# Altium project Cashstick.PrjPcb
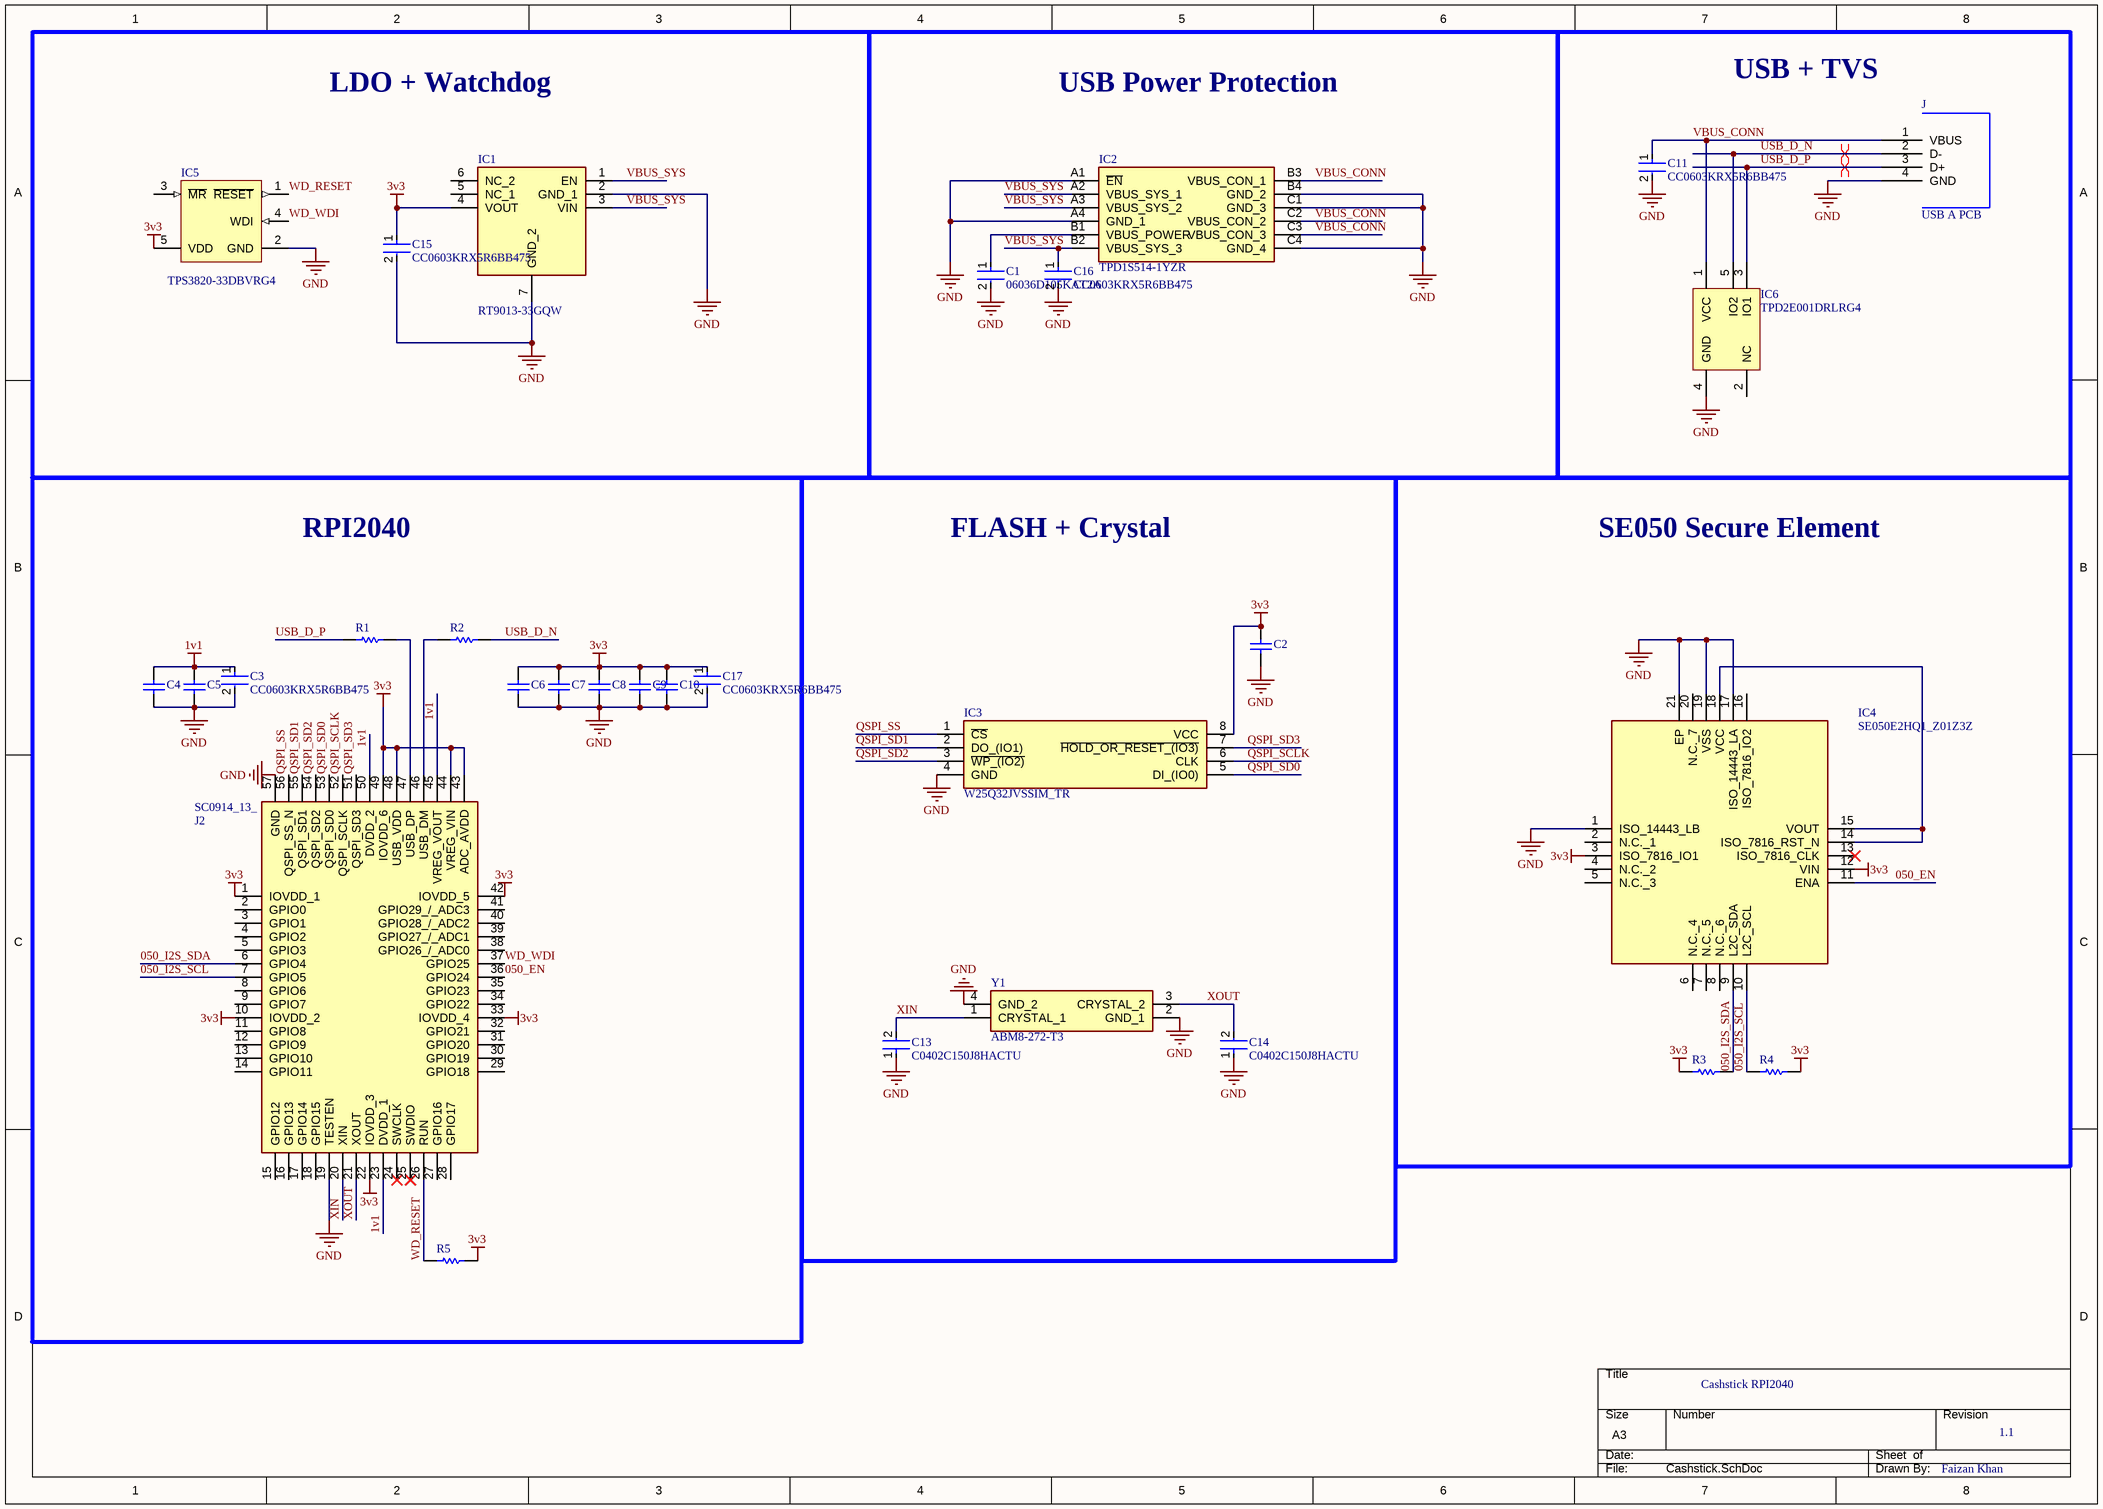
[diagram p0: Cashstick.SchDoc]
1 sheet, 30 parts. Net scope: global (net labels, ports and power ports of the same name join across sheets).
Board file: Cashstick.PcbDoc

## Sheet Cashstick.SchDoc: Cashstick RPI2040
size A3; DrawnBy: Faizan Khan; Organization: ORGANIZATION; Address1: ADDRESS 1; Address2: ADDRESS 2; Address3: ADDRESS 3; Address4: ADDRESS 4; Revision: 1.1; SheetNumber: 1; SheetTotal: 1; ENG_APP_DATE: --/--/--; DSN_APP_DATE: --/--/--; CHK_APP_DATE: --/--/--

### Parts
C1  06036D105KAT2A  [FP-0603-L_1_6_0_15-W_0_81-IPC_A]
C2  0402YC104JAT2A  [CAPC1005X56X25LL10T15]  (value not drawn)
C3  CC0603KRX5R6BB475  [FP-CC0603-DA-MFG]
C4  0402YC104JAT2A  [CAPC1005X56X25LL10T15]  (value not drawn)
C5  0402YC104JAT2A  [CAPC1005X56X25LL10T15]  (value not drawn)
C6  0402YC104JAT2A  [CAPC1005X56X25LL10T15]  (value not drawn)
C7  0402YC104JAT2A  [CAPC1005X56X25LL10T15]  (value not drawn)
C8  0402YC104JAT2A  [CAPC1005X56X25LL10T15]  (value not drawn)
C9  0402YC104JAT2A  [CAPC1005X56X25LL10T15]  (value not drawn)
C10  0402YC104JAT2A  [CAPC1005X56X25LL10T15]  (value not drawn)
C11  CC0603KRX5R6BB475  [FP-CC0603-DA-MFG]
C13  C0402C150J8HACTU  [FP-C0402-BB-MFG]
C14  C0402C150J8HACTU  [FP-C0402-BB-MFG]
C15  CC0603KRX5R6BB475  [FP-CC0603-DA-MFG]
C16  CC0603KRX5R6BB475  [FP-CC0603-DA-MFG]
C17  CC0603KRX5R6BB475  [FP-CC0603-DA-MFG]
IC1  RT9013-33GQW  [SON65P200X200X80-7N]
IC2  TPD1S514-1YZR  [BGA12C40P4X3_199X129X62]
IC3  W25Q32JVSSIM_TR  [SOIC127P790X216-8N]
IC4  SE050E2HQ1_Z01Z3Z  [QFN40P300X300X33-21N-D]
IC5  TPS3820-33DBVRG4  [TI-DBV5_V]
IC6  TPD2E001DRLRG4  [DRL0005A_L]
J  USB A PCB  [USB PCB TRACE]
J2  SC0914_13_  [SC091413]
R1  CR0402-FX-27R4GLF  [RESC1005X40X25ML10T10]  (value not drawn)
R2  CR0402-FX-27R4GLF  [RESC1005X40X25ML10T10]  (value not drawn)
R3  2K2 5% 0402(1005)  [RESC0402(1005)_N]  (value not drawn)
R4  2K2 5% 0402(1005)  [RESC0402(1005)_N]  (value not drawn)
R5  TNPW040210K0DEED  [RESC1005X40X20NL05T10]  (value not drawn)
Y1  ABM8-272-T3  [ABM8272T3]

### Blocks framed on the sheet
LDO + Watchdog: C15 IC1 IC5
USB Power Protection: C1 C16 IC2
USB + TVS: C11 IC6 J
RPI2040: C3-C10 C17 J2 R1 R2 R5
FLASH + Crystal: C2 C13 C14 IC3 Y1
SE050 Secure Element: IC4 R3 R4

### Nets
1v1: C3.1 C4.2 C5.2 J2.23(DVDD_1) J2.45(VREG_VOUT) J2.50(DVDD_2)
3v3: C2.2 C6.2 C7.2 C8.2 C9.2 C10.2 C15.1 C17.1 IC1.4(VOUT) IC3.8(VCC) IC4.3(ISO_7816_IO1) IC4.12(VIN) IC5.5(VDD) J2.1(IOVDD_1) J2.10(IOVDD_2) J2.22(IOVDD_3) J2.33(IOVDD_4) J2.42(IOVDD_5) J2.43(ADC_AVDD) J2.44(VREG_VIN) J2.48(USB_VDD) J2.49(IOVDD_6) R3.1 R4.2 R5.2
GND: C1.2 C2.1 C3.2 C4.1 C5.1 C6.1 C7.1 C8.1 C9.1 C10.1 C11.2 C13.1 C14.1 C15.2 C16.2 C17.2 IC1.2(GND_1) IC1.7(GND_2) IC2.A1(~{EN}) IC2.A4(GND_1) IC2.B4(GND_2) IC2.C1(GND_3) IC2.C4(GND_4) IC3.4(GND) IC4.1(ISO_14443_LB) IC4.17(ISO_14443_LA) IC4.19(VSS) IC4.21(EP) IC5.2(GND) IC6.4(GND) J.4(GND) J2.19(TESTEN) J2.57(GND) Y1.2(GND_1) Y1.4(GND_2)
050_EN: IC4.11(ENA) J2.36(GPIO24)
050_I2S_SCL: IC4.10(L2C_SCL) J2.7(GPIO5) R4.1
050_I2S_SDA: IC4.9(L2C_SDA) J2.6(GPIO4) R3.2
QSPI_SCLK: IC3.6(CLK) J2.52(QSPI_SCLK)
QSPI_SD0: IC3.5(DI_(IO0)) J2.53(QSPI_SD0)
QSPI_SD1: IC3.2(DO_(IO1)) J2.55(QSPI_SD1)
QSPI_SD2: IC3.3(~{WP_(IO2)}) J2.54(QSPI_SD2)
QSPI_SD3: IC3.7(~{HOLD_OR_RESET_(IO3)}) J2.51(QSPI_SD3)
QSPI_SS: IC3.1(~{CS}) J2.56(QSPI_SS_N)
USB_D_N: IC6.5(IO2) J.2(D-) R2.2
USB_D_P: IC6.3(IO1) J.3(D+) R1.1
VBUS_CONN: C11.1 IC2.B3(VBUS_CON_1) IC2.C2(VBUS_CON_2) IC2.C3(VBUS_CON_3) IC6.1(VCC) J.1(VBUS)
VBUS_SYS: C16.1 IC1.1(EN) IC1.3(VIN) IC2.A2(VBUS_SYS_1) IC2.A3(VBUS_SYS_2) IC2.B2(VBUS_SYS_3)
WD_RESET: IC5.1(~{RESET}) J2.26(RUN) R5.1
WD_WDI: IC5.4(WDI) J2.37(GPIO25)
XIN: C13.2 J2.20(XIN) Y1.1(CRYSTAL_1)
XOUT: C14.2 J2.21(XOUT) Y1.3(CRYSTAL_2)
NetC1_1: C1.1 IC2.B1(VBUS_POWER)
NetIC4_14: IC4.14(ISO_7816_RST_N) IC4.15(VOUT) IC4.18(VCC)
NetJ2_46: J2.46(USB_DM) R2.1
NetJ2_47: J2.47(USB_DP) R1.2

Not connected (* = marked no-connect by the designer): IC1 5(NC_1) 6(NC_2); IC4 2(N.C._1) 4(N.C._2) 5(N.C._3) 6(N.C._4) 7(N.C._5) 8(N.C._6) 13(ISO_7816_CLK)* 16(ISO_7816_IO2) 20(N.C._7); IC5 3(~{MR}); IC6 2(NC); J2 2(GPIO0) 3(GPIO1) 4(GPIO2) 5(GPIO3) 8(GPIO6) 9(GPIO7) 11(GPIO8) 12(GPIO9) 13(GPIO10) 14(GPIO11) 15(GPIO12) 16(GPIO13) 17(GPIO14) 18(GPIO15) 24(SWCLK)* 25(SWDIO)* 27(GPIO16) 28(GPIO17) 29(GPIO18) 30(GPIO19) 31(GPIO20) 32(GPIO21) 34(GPIO22) 35(GPIO23) 38(GPIO26_/_ADC0) 39(GPIO27_/_ADC1) 40(GPIO28_/_ADC2) 41(GPIO29_/_ADC3)

### Layout directives
differential pair: USB_D_N, USB_D_P

### Notes on the sheet
- THIS DOCUMENT AND THE DATA DISCLOSED HEREIN OR
- HEREWITH IS THE PROPERTY OF ALTIUM LIMITED AND MAY
- DWG NO:
- REVISION
- REV:
- DESCRIPTION
- DATE
- APPROVED
- BE FREELY DISTRIBUTED IN WHOLE. NO RIGHTS ARE
- RESERVED OR EXPRESS OR IMPLIED WARANTEE GIVEN.
- ENG:
- APPROVALS
- PROJECT
- DSN:
- CHK:
- REFERENCE DOCUMENTS
- PROJECT REVISION:
- TITLE
- DOCUMENT REVISION:
- DESIGN ITEM:
- BOM:
- FAB DWG:
- PCB DWG:
- ASSY DWG:
- SCALE:
- A3
- SIZE
- CAGE CODE
- FILE NAME
- DWG NO.
- SHEET
- OF
- REV

### Library data of the parts
C1 = CMP-2006-04474-2: General Purpose Ceramic Capacitor, 0603, 1uF, 10%, X5R, 15%, 6.3V; Insulation Resistance: 100GR; Dissipation Factor: 5%; Package Quantity: 1; Mount: Surface Mount; Series: -; Number of Pins: 2; Length: 1.6mm; RoHS Compliant: Yes; Capacitance: 1uF; Depth: 0.81mm; Case Code (Imperial): 0603; Lead Free: Lead Free; Max Operating Temperature: 85°C; Case Code (Metric): 1608; Min Operating Temperature: -55°C; Contact Plating: Tin; Voltage: 6.3V; Tolerance: 10%; Width: 0.032inch; Voltage Rating (DC): 6.3V; Voltage Rating: 6.3V; Termination: SMD/SMT; Radiation Hardening: No; Case/Package: 0603; Thickness: 0.035inch; Height: 0.9mm; REACH SVHC: No SVHC; Packaging: Tape and Reel; Construction: Flat; Dielectric: X5R
C2 C4-C10 = CMP-2008-02926-1: Manufacturer: AVX Interconnect / Elco; Part Number: 0402YC104JAT2A
C3 C11 C15-C17 = CMP-2000-06074-2: CAP CER 4.7UF 10V X5R 0603; Manufacturer: YAGEO; Temperature Coefficient: 15%; Tolerance: 0.1; Material: Ceramic; Voltage Rating: 10 V; ComponentLink2URL: http://www.yageo.com/documents/recent/UPY-GPHC_X7R_6.3V-to-50V_18.pdf; Package: CC0603-DA; Temperature Range High: +125°C; Category: Cap; ComponentLink2Description: Datasheet; Lead Free: Yes; Mouser Description: 4.7µF Surface Mount, MLCC 0603 (1608 Metric) Package Ceramic Capacitors; Manufacturer Part Number: CC0603KRX5R6BB475; Device Class L2: Capacitors; Temperature Characteristic: X5R; Voltage: 10 V; RoHS: TRUE; Octopart: https://octopart.com/cc0603krx5r6bb475-yageo-9292507; Automotive: No; Height: 0.9mm; Temperature: -55°C to +125°C; Temperature Range Low: -55°C; Value: 4.7 uF; Digikey Description: CAP CER 4.7UF 10V X5R 0603; Device Class L1: Passive Components; Capacitance: 4.7 uF; Footprint Url: http://www.yageo.com/exep/pages/download/literatures/UPY-C_GEN_24.pdf; Device Class L3: Ceramic Capacitors
C13 C14 = CMP-03020-013640-1: C0402 15 pF X8R 5.00% 10 V; Manufacturer: Kemet; Value: 15 pF; Tolerance: 0.05; Voltage Rating: 10 V; Material: Ceramic; Temperature Coefficient: 15%; Device Class L2: Capacitors; Capacitance: 15 pF; Octopart: https://octopart.com/c0402c150j8hactu-kemet-88724175; Automotive: No; Manufacturer Part Number: C0402C150J8HACTU; ComponentLink2URL: https://content.kemet.com/datasheets/KEM_C1002_X7R_SMD.pdf; Device Class L1: Passive Components; Ipc Land Pattern Name: CAPC10050X50; Temperature: -55°C to +125°C; Height: 0.55mm; Temperature Range Low: -55°C; Temperature Characteristic: X8R; Temperature Range High: +125°C; Package: C0402-BB; Category: Cap; Device Class L3: Ceramic Capacitors; Lead Free: Yes; ComponentLink2Description: Datasheet; RoHS: TRUE
IC1 = RT9013-33GQW: Integrated Circuit; Manufacturer_Name: RICHTEK; Datasheet Link: https://eu.mouser.com/datasheet/2/1458/DS9013_10-3104853.pdf; Height: 0.8mm; Manufacturer_Part_Number: RT9013-33GQW; Mouser Part Number: 835-RT9013-33GQW; Mouser Price/Stock: https://www.mouser.co.uk/ProductDetail/Richtek/RT9013-33GQW?qs=amGC7iS6iy%2Fa0fR0lBiZlg%3D%3D
IC2 = TPD1S514-1YZR: Integrated Circuit; Manufacturer_Name: Texas Instruments; Datasheet Link: http://www.ti.com/lit/gpn/tpd1s514; Height: 0.625mm; Manufacturer_Part_Number: TPD1S514-1YZR; Mouser Part Number: 595-TPD1S514-1YZR; Mouser Price/Stock: https://www.mouser.co.uk/ProductDetail/Texas-Instruments/TPD1S514-1YZR?qs=U0ECReq1GB8vEu4GjuBhFg%3D%3D; Arrow Part Number: TPD1S514-1YZR; Arrow Price/Stock: https://www.arrow.com/en/products/tpd1s514-1yzr/texas-instruments
IC3 = W25Q32JVSSIM_TR: Integrated Circuit; Manufacturer_Name: Winbond; Manufacturer_Part_Number: W25Q32JVSSIM TR; Datasheet Link: https://www.mouser.com/datasheet/2/949/w25q32jv_dtr_revg_03272018_plus-1489786.pdf; Height: 2.16mm; Mouser Part Number: 454-W25Q32JVSSIMTR; Mouser Price/Stock: https://www.mouser.co.uk/ProductDetail/Winbond/W25Q32JVSSIM-TR?qs=qSfuJ%252Bfl%2Fd55hO45Ox4sXQ%3D%3D; Arrow Part Number: W25Q32JVSSIM TR; Arrow Price/Stock: https://www.arrow.com/en/products/w25q32jvssimtr/winbond-electronics?utm_currency=USD&region=nac
IC4 = SE050E2HQ1_Z01Z3Z: Integrated Circuit; Manufacturer_Name: NXP; Manufacturer_Part_Number: SE050E2HQ1/Z01Z3Z; Datasheet Link: https://www.nxp.com/docs/en/package-information/SOT1969-1.pdf; Height: 0.33mm; Mouser Part Number: 771-SE050E2HQ1Z01Z3Z; Mouser Price/Stock: https://www.mouser.co.uk/ProductDetail/NXP-Semiconductors/SE050E2HQ1-Z01Z3Z?qs=MyNHzdoqoQJLcBuQE9NcBA%3D%3D; Arrow Part Number: SE050E2HQ1/Z01Z3Z; Arrow Price/Stock: https://www.arrow.com/en/products/se050e2hq1z01z3z/nxp-semiconductors?utm_currency=USD&region=nac
IC5 = CMP-0338-00012-1: Processor Supervisory Circuit, 1 Supply Monitored, -40 to 85 degC, 5-Pin SOT-23 (DBV), Green (RoHS & no Sb/Br); Manufacturer: Texas Instruments; Watchdog Timer WDI: 0.2 s; Threshold Voltage: 2.93 V Typ.; VCC: 1.1 V Min.; Time Delay: 25 ms; # of Supplies Monitored: 1; Packing: Tape and Reel; Iq: 15 uA Typ.; Rating: Catalog; Reset Threshold Accuracy: 2.4%; Output Driver Type / Reset Output: Active-low, Push-pull; DatasheetVersion: SLVS165J; PackageDescription: 5-Pin Plastic Small Outline, Body 1.6 x 2.9 mm, Pitch 0.95 mm; RoHS: TRUE; ComponentLink2Description: Datasheet; PartNumber: TPS3820-33DBVRG4; ComponentLink2URL: http://www.ti.com/lit/ds/symlink/tps3820-33.pdf; PackageVersion: 4073253-4/L; ComponentLink1Description: Manufacturer URL; ComponentLink1URL: www.ti.com; Operating Temperature Range: -40 to 85 degC; ComponentLink3Description: Package Specification; ComponentLink3URL: http://www.ti.com/lit/ml/mpds018j/mpds018j.pdf; Mounting Technology: Surface Mount
IC6 = CMP-0326-00050-2: Low-Capacitance + / - 15 kV ESD-Protection Array for High-Speed Data Interfaces, 2 Channels, -40 to +85 degC, 5-pin SOT (DRL), Green (RoHS & no Sb/Br); Manufacturer: Texas Instruments; USB High Speed: TRUE; IO Leakage Current(nA): 1; IEC 61000-4-2 Contact(+/- kV): 8; Breakdown Voltage(Min)(V): 11; IEC 61000-4-2 Air-Gap(+/- kV): 15; IO Capacitance(Typ)(pF): 1.5; SubFamily: ESD Solution; Eco-Plan: Green (RoHS & no Sb/Br); PackageDescription: 5-Pin Plastic Small Outline, Flat Lead 0.5 mm Pitch; ComponentLink2Description: Datasheet; ComponentLink3URL: SamplesURL:http://www.ti.com/product/tpd2e001#samples; ComponentLink1URL: http://www.ti.com/; PartNumber: TPD2E001DRLRG4; DatasheetVersion: SLLS684F; PackageVersion: revD, Aug-2007; PackageReference: DRL0005A; ComponentLink2URL: http://www.ti.com/general/docs/lit/getliterature.tsp?genericPartNumber=TPD2E001&fileType=pdf; Mounting Technology: Surface Mount; ComponentLink1Description: Manufacturer URL; ComponentLink3Description: URL Link1
J2 = SC0914_13_: Connector; Manufacturer_Name: RASPBERRY-PI; Manufacturer_Part_Number: SC0914(13); Datasheet Link: https://datasheets.raspberrypi.com/rp2040/rp2040-datasheet.pdf; Height: 0.9mm; Mouser Part Number: 358-SC091413; Mouser Price/Stock: https://www.mouser.co.uk/ProductDetail/Raspberry-Pi/SC091413?qs=T%252BzbugeAwjhr%252BUbBr3TJcw%3D%3D
R1 R2 = CMP-2002-05023-1: Manufacturer: Bourns; Part Number: CR0402-FX-27R4GLF
R3 R4 = CMP-1011-00082-1: 2K2 0.063W 5% 0402 (1005 Metric)  SMD; Value: 2200.00 Ohm; Case-EIA: 0402; Case-Metric: 1005; Tolerance: 5 %; Power: 0.063 W; Technology: SMT
R5 = CMP-2002-01682-1: Manufacturer: Vishay BCcomponents; Part Number: TNPW040210K0DEED
Y1 = ABM8-272-T3: Crystal or Oscillator; Manufacturer_Name: ABRACON; Datasheet Link: https://abracon.com/datasheets/ABM8-272-T3.pdf; Height: 0.8mm; Manufacturer_Part_Number: ABM8-272-T3; Mouser Part Number: 815-ABM8-272-T3; Mouser Price/Stock: https://www.mouser.co.uk/ProductDetail/ABRACON/ABM8-272-T3?qs=QpmGXVUTftEj6miOiJBMxQ%3D%3D